# EAGLE schematic neopixel_board (EAGLE 9.2.0)
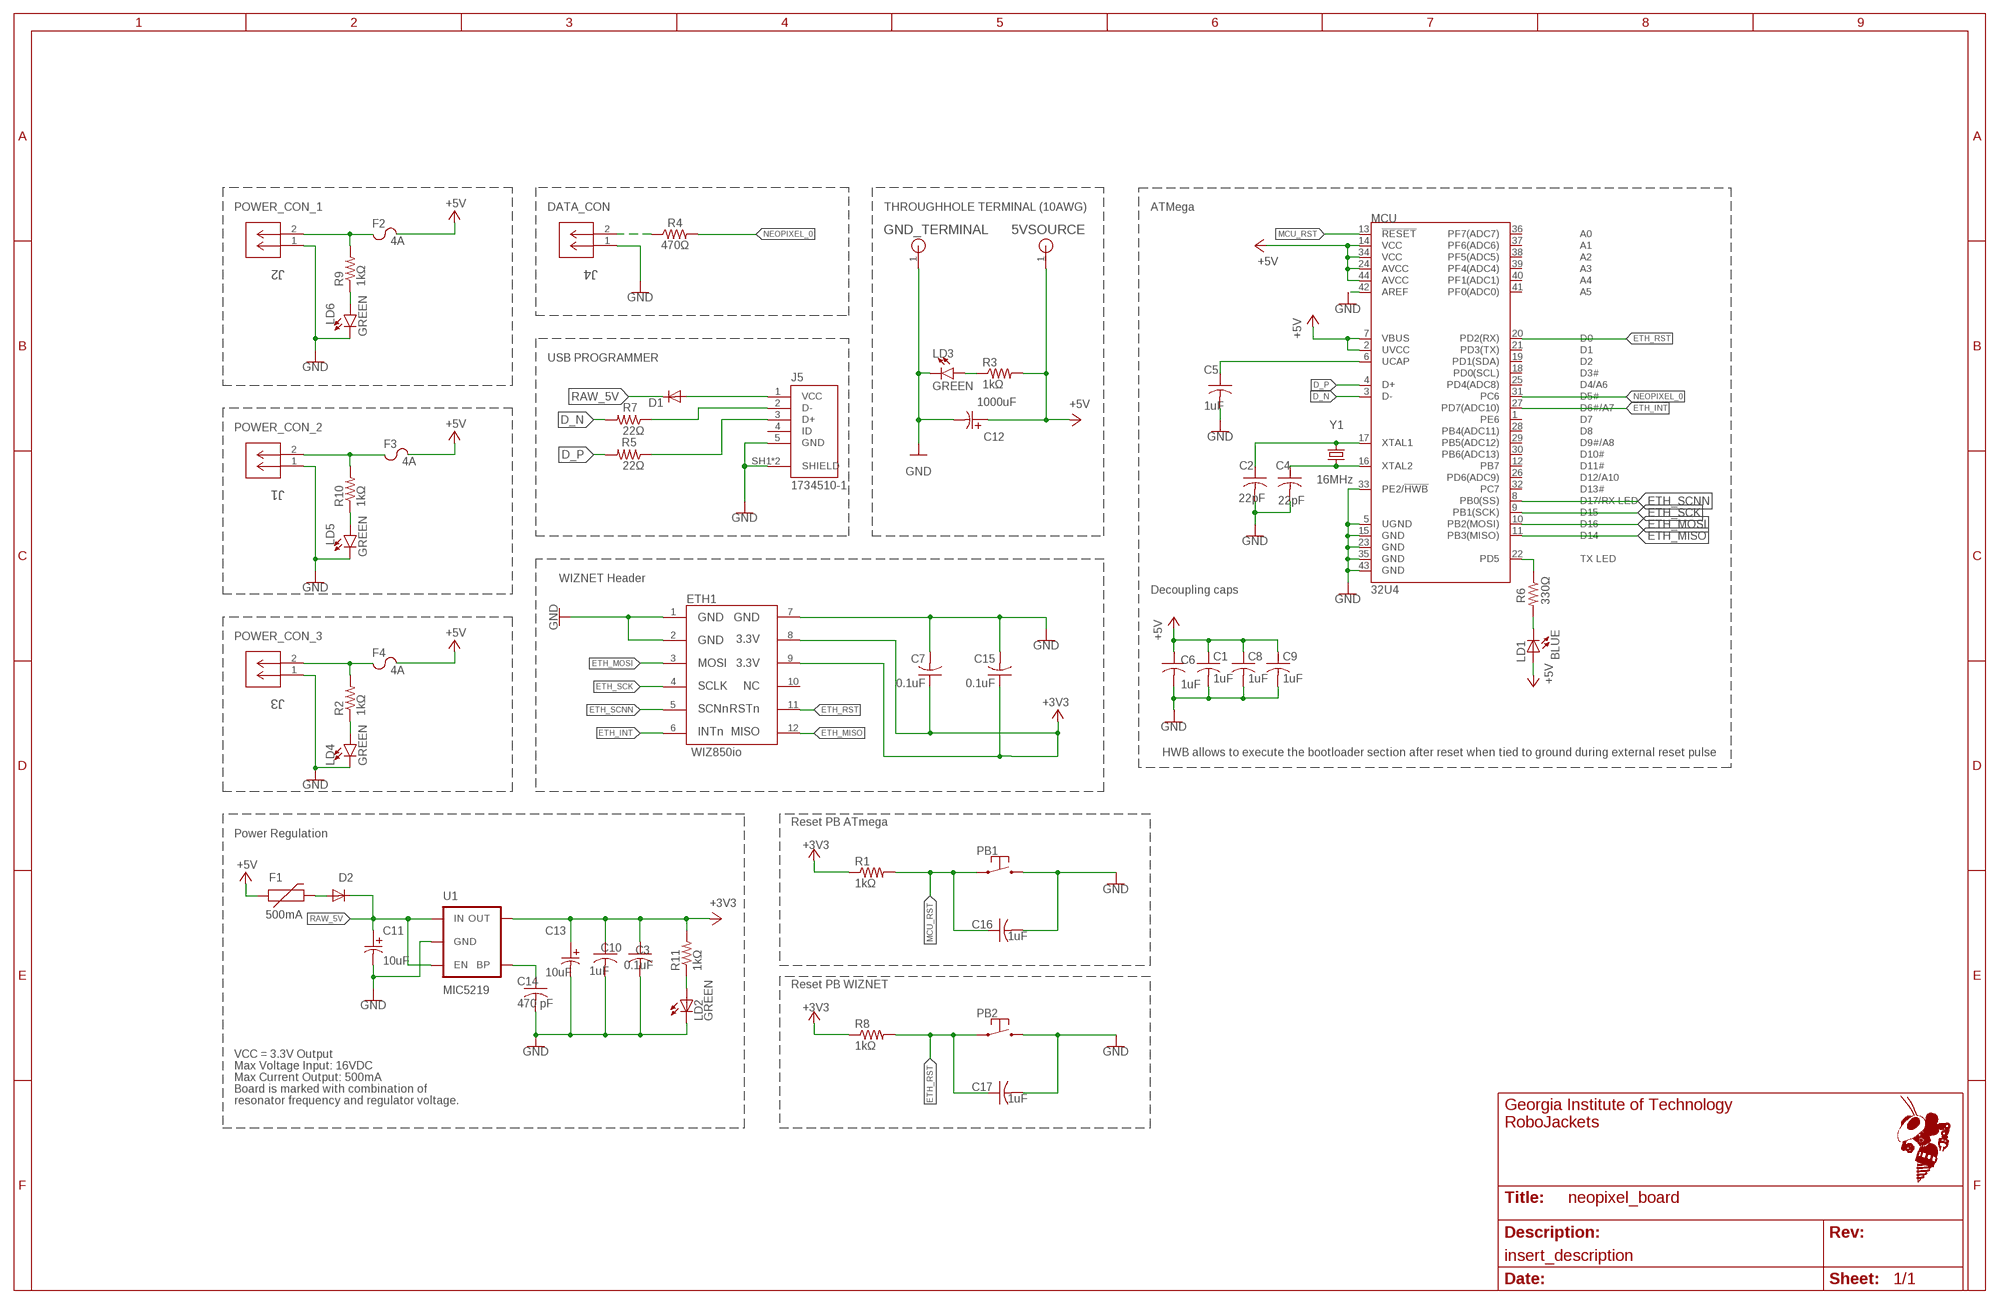
[diagram p0: schematic, sheet 1]
FRAME2 (FRAME_B_L): SCH_DESC: insert_description

## Parts
5VSOURCE  THOLE_SOURCE  [THOLE_SOURCE]
C1  1uF  C-USC0603  [C0603]
C2  22pF  C-USC0603  [C0603]
C3  0.1uF  C-USC0603  [C0603]
C4  22pF  C-USC0603  [C0603]
C5  1uF  C-USC0603  [C0603]
C6  1uF  C-USC0603  [C0603]
C7  0.1uF  C-USC0603  [C0603]
C8  1uF  C-USC0603  [C0603]
C9  1uF  C-USC0603  [C0603]
C10  1uF  C-USC0603  [C0603]
C11  10uF  EEE-1CA100SR  [CAP_4_X_5.4]
C12  1000uF  ECA-0JM102  [PCAP_8X112]
C13  10uF  EEE-1CA100SR  [CAP_4_X_5.4]
C14  470 pF  C-USC0603  [C0603]
C15  0.1uF  C-USC0603  [C0603]
C16  1uF  C-USC0603  [C0603]
C17  1uF  C-USC0603  [C0603]
D1  DIODESOD  [SOD-323]
D2  DIODESOD  [SOD-323]
ETH1  WIZ850IO  [WIZ850IO]
F1  500mA  PTCSMD  [PTC-1206]
F2  4A  3557-2  [3557-2]
F3  4A  3557-2  [3557-2]
F4  4A  3557-2  [3557-2]
GND_TERMINAL  THOLE_SOURCE  [THOLE_SOURCE]
J1  SSW-102-02-T-S-RA  [CON2_1X2_TR_SSQ]
J2  SSW-102-02-T-S-RA  [CON2_1X2_TR_SSQ]
J3  SSW-102-02-T-S-RA  [CON2_1X2_TR_SSQ]
J4  SSW-102-02-T-S-RA  [CON2_1X2_TR_SSQ]
J5  1734510-1  [TE_1734510-1]
LD1  BLUE  LED0603  [LED-0603]
LD2  GREEN  LED0603  [LED-0603]
LD3  GREEN  LED-GREEN0603  [LED-0603]
LD4  GREEN  LED-GREEN0603  [LED-0603]
LD5  GREEN  LED-GREEN0603  [LED-0603]
LD6  GREEN  LED-GREEN0603  [LED-0603]
MCU  32U4  ATMEGA32U4TQFP-44  [TQFP44]
PB1  PTS645PTS645_SMD1  [PTS645_SMD]
PB2  PTS645PTS645_SMD1  [PTS645_SMD]
R1  1kΩ  R-US_R0603  [R0603]
R2  1kΩ  RESISTOR0603-RES  [0603-RES]
R3  1kΩ  RESISTOR0603-RES  [0603-RES]
R4  470Ω  470OHM-0603-1/10W-1%  [0603]
R5  22Ω  RESISTOR0603-RES  [0603-RES]
R6  330Ω  RESISTOR0603-RES  [0603-RES]
R7  22Ω  RESISTOR0603-RES  [0603-RES]
R8  1kΩ  R-US_R0603  [R0603]
R9  1kΩ  RESISTOR0603-RES  [0603-RES]
R10  1kΩ  RESISTOR0603-RES  [0603-RES]
R11  1kΩ  RESISTOR0603-RES  [0603-RES]
U1  MIC5219  V_REG_LDOSMD  [SOT23-5]
Y1  16MHz  CRYSTAL5X3  [CRYSTAL-SMD-5X3]

## Nets
+3V3: C3.1 C7.1 C10.1 C13.1 C15.1 ETH1.8 ETH1.9 R1.1 R8.1 R11.2 U1.5(OUT)
+5V: 5VSOURCE.1 C1.1 C6.1 C8.1 C9.1 C12.1 F1.1 F2.3 F2.4 F3.3 F3.4 F4.3 F4.4 LD1.A MCU.2(UVCC) MCU.7(VBUS) MCU.14(VCC) MCU.24(AVCC) MCU.34(VCC) MCU.44(AVCC) R3.2
D_N [diff_pair]: MCU.3(D-) R7.2
D_P [diff_pair]: MCU.4(D+) R5.2
ETH_INT: ETH1.6 MCU.27(PD7(ADC10))
ETH_MISO: ETH1.12 MCU.11(PB3(MISO))
ETH_MOSI: ETH1.3 MCU.10(PB2(MOSI))
ETH_RST: C17.1 ETH1.11 MCU.20(PD2(RX)) PB2.P$1 PB2.P$2 R8.2
ETH_SCK: ETH1.4 MCU.9(PB1(SCK))
ETH_SCNN: ETH1.5 MCU.8(PB0(SS))
GND [vcc]: C1.2 C2.2 C3.2 C4.2 C5.2 C6.2 C7.2 C8.2 C9.2 C10.2 C11.2 C12.2 C13.2 C14.2 C15.2 C16.2 C17.2 ETH1.1 ETH1.2 ETH1.7 GND_TERMINAL.1 J1.1 J2.1 J3.1 J4.1 J5.5(GND) J5.SH1(SHIELD) J5.SH2(SHIELD) LD2.C LD3.C LD4.C LD5.C LD6.C MCU.5(UGND) MCU.15(GND) MCU.23(GND) MCU.33(PE2/!HWB) MCU.35(GND) MCU.42(AREF) MCU.43(GND) PB1.P$3 PB1.P$4 PB2.P$3 PB2.P$4 U1.2(GND)
MCU_RST: C16.1 MCU.13(!RESET) PB1.P$1 PB1.P$2 R1.2
N$1: C4.1 MCU.16(XTAL2) Y1.1
N$2: C2.1 MCU.17(XTAL1) Y1.3
N$3: J5.2(D-) R7.1
N$4: C5.1 MCU.6(UCAP)
N$5: C14.1 U1.4(BP)
N$6: J5.3(D+) R5.1
N$7: LD1.C R6.2
N$8: D1.2(A) J5.1(VCC)
N$9: D2.2(A) F1.2
N$10: F2.1 F2.2 J2.2 R9.2
N$11: F3.1 F3.2 J1.2 R10.2
N$12: F4.1 F4.2 J3.2 R2.2
N$13: J4.2 R4.1
N$14: LD4.A R2.1
N$15: LD5.A R10.1
N$16: LD6.A R9.1
N$21: LD3.A R3.1
N$38: LD2.A R11.1
NEOPIXEL_0: MCU.31(PC6) R4.2
RAW_5V [vcc]: C11.1 D1.1(C) D2.1(C) U1.1(IN) U1.3(EN)
TXLED: MCU.22(PD5) R6.1
Unconnected: ETH1.10 J5.4(ID) MCU.1(PE6) MCU.12(PB7) MCU.18(PD0(SCL)) MCU.19(PD1(SDA)) MCU.21(PD3(TX)) MCU.25(PD4(ADC8)) MCU.26(PD6(ADC9)) MCU.28(PB4(ADC11)) MCU.29(PB5(ADC12)) MCU.30(PB6(ADC13)) MCU.32(PC7) MCU.36(PF7(ADC7)) MCU.37(PF6(ADC6)) MCU.38(PF5(ADC5)) MCU.39(PF4(ADC4)) MCU.40(PF1(ADC1)) MCU.41(PF0(ADC0))

## Notes on the sheet
- POWER_CON_1 | DATA_CON | THROUGHHOLE TERMINAL (10AWG) | ATMega
- USB PROGRAMMER
- POWER_CON_2
- WIZNET Header
- Decoupling caps
- POWER_CON_3
- HWB allows to execute the bootloader section after reset when tied to ground during external reset pulse
- Reset PB ATmega
- Power Regulation
- Reset PB WIZNET
- VCC = 3.3V Output
- Max Voltage Input: 16VDC
- Max Current Output: 500mA
- Board is marked with combination of
- resonator frequency and regulator voltage.

## Library data of the parts
5VSOURCE GND_TERMINAL = neopixel_board:THOLE_SOURCE
C1-C6 C8-C10 C16 C17 = rcl:C-US: CAPACITOR, American symbol; SPICEPREFIX: C
C7 C14 C15 = rcl:C-US: CAPACITOR, American symbol; SPICEPREFIX: 0.1 uF
C11 C13 = neopixel_board:EEE-1CA100SR
C12 = neopixel_board:ECA-0JM102; MANUFACTURER_PART_NUMBER: ECA0JM102; VENDOR: Panasonic
D1 D2 = SparkFun:DIODE: Diode These are standard reverse protection diodes and small signal diodes. SMA package can handle up to about 1A. SOD-323 can handle about 200mA. What the SOD-323 package when ordering, there are some mfgs out there that are 5-pin packages.
ETH1 = neopixel_board:WIZ850IO
F1 = SparkFun:PTC: Resettable Fuse PTC Resettable Fuse. Spark Fun Electronics SKU : COM-08357
F2-F4 = neopixel_board:3557-2; DIGIKEY: 36-3557-2-ND; MPN: 3557-2
J1-J4 = neopixel_board:SSW-102-02-T-S-RA: 2 postion, right-angle, female header; MANUFACTURER_PART_NUMBER: SSW10202TSRA; VENDOR: Samtec Inc
J5 = 1734510-1:1734510-1: Conn Mini USB Type B RCP 5 POS 1.6mm Solder RA Thru-Hole 5 Terminal 1 Port Tray; MANUFACTURER: TE Connectivity; PARTREV: B1; STANDARD: Manufacturer Recommendation
LD1 LD2 = SparkFun:LED: LEDs Standard schematic elements and footprints for 5mm, 3mm, 1206, and 0603 sized LEDs. 5mm - Spark Fun Electronics SKU : COM-00529 (and others)
LD3-LD6 = SparkFun-LED:LED-GREEN: Green SMD LED Used in manufacturing of various products at SparkFun Packages: 0603 - SMD 0603 package [Product Link] <http://www.futureelectronics.com/en/technologies/semiconductors/optoelectronics/leds/Pages/9894312-LTST-C190GKT.aspx?CrossPart=HSMG-C190&IM=0> LilyPad 1206 - SMD1206 LilyPad package [Product Link] <http://www.futureelectronics.com/en/Technologies/Product.aspx?ProductID=IN150NGHARVATEKCORPORATION2049943&IM=0> 1206 - SMD1206 package [Product Link] <http://www.futureelectronics.com/en/technologies/semiconductors/optoelectronics/leds/Pages/8315665-LTST-C150KGKT.aspx?IM=0> 1206 Bottom Mount -SMD 1206 Bottom Mount [Product Link] <http://www.digikey.com/product-detail/en/lite-on-inc/LTST-C230KGKT/160-1456-1-ND/386854> SparkFun Products: Pro Mini 328 -5V <https://www.sparkfun.com/products/821> RedBoard <https://www.sparkfun.com/products/12757> MP3 Trigger <https://www.sparkfun.com/products/13720> Makey Makey <https://www.sparkfun.com/products/11076>; PROD_ID: DIO-00821
MCU = SparkFun-IC-Microcontroller:ATMEGA32U4: Atmel MCU, 32KByte Atmel 44-pin 8-bit Microcontroller with 32KBytes of ISP Flash and USB Controller Datasheet <http://cdn.sparkfun.com/datasheets/Dev/Arduino/Boards/ATMega32U4.pdf> SparkFun Products LilyPad Arduino USB - ATmega32U4 Board <https://www.sparkfun.com/products/12049> (DEV-12049) Pro Micro - 5V/16MHz <https://www.sparkfun.com/products/12640> (DEV-12640) Pro Micro - 3.3V/8MHz <https://www.sparkfun.com/products/12587> (DEV-12587) Fio v3 - ATmega32U4 <https://www.sparkfun.com/products/11520> (DEV-11520) Qduino Mini <https://www.sparkfun.com/products/13614> (DEV-13614) Makey Makey - Standard Kit <https://www.sparkfun.com/products/11511> (WIG-11511) Makey Makey Deluxe Kit <https://www.sparkfun.com/products/11519> (WIG-11519); PROD_ID: IC-11161
PB1 PB2 = Training_Board:PTS645: Tactile Momentary Pushbutton with thru-hole legs. https://www.ckswitches.com/media/1471/pts645.pdf
R1 R8 = rcl:R-US_: RESISTOR, American symbol; SPICEPREFIX: R
R2 R3 R5-R7 R9-R11 = SparkFun:RESISTOR: Resistor Basic schematic elements and footprints for 0603, 1206, and PTH resistors.
R4 = SparkFun-Resistors:470OHM: 470Ω resistor A resistor is a passive two-terminal electrical component that implements electrical resistance as a circuit element. Resistors act to reduce current flow, and, at the same time, act to lower voltage levels within circuits. - Wikipedia; PROD_ID: RES-07869; VALUE: 470
U1 = SparkFun:V_REG_LDO: Voltage Regulator LDO Standard 150mA LDO voltage regulator in SOT-23 layout. Micrel part MIC5205. BP (by-pass) pin is used to lower output noise with 470pF cap.
Y1 = SparkFun:CRYSTAL: Crystals Various standard crystals. Proven footprints. Spark Fun Electronics SKU : COM-00534

## Net classes
2 diff_pair: width 0.305 mm